# EAGLE design sci fair schematic (EAGLE 7.4.0)
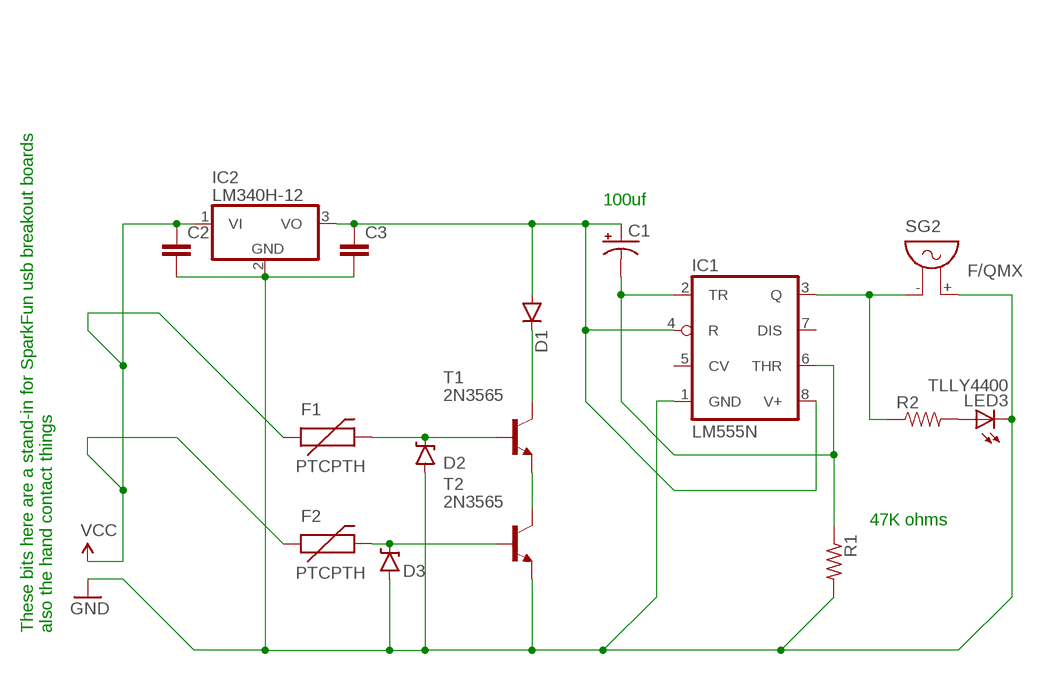
[diagram p0: schematic, sheet 1]

## Parts
C1  CAP_POLPTH1  [CPOL-RADIAL-100UF-25V]
C2  C5/2.5  [C5B2.5]
C3  C5/2.5  [C5B2.5]
D1  DIODEPTH  [DIODE-1N4001]
D2  DIODE-ZENERPTH  [DIODE-ZENER]
D3  DIODE-ZENERPTH  [DIODE-ZENER]
F1  PTCPTH  [PTC]
F2  PTCPTH  [PTC]
IC1  LM555N  [DIL08]
IC2  LM340H-12  [TO220H]
LED3  TLLY4400  [LED3MM]
R1  R-US_0207/12  [0207/12]
R2  RESISTORPTH-1/2W  [AXIAL-0.5]
SG2  F/QMX  [F/QMX]
T1  2N3565  [TO92]
T2  2N3565  [TO92]

## Nets
5V: C1.1(+) C3.1 D1.A IC1.4(R) IC1.8(V+) IC2.3(VO)
GND: C2.2 C3.2 D2.P$2(A) D3.P$2(A) IC1.1(GND) IC2.2(GND) LED3.K(C) R1.2 SG2.+ T2.3(E)
N$4: T1.3(E) T2.1(C)
N$7: D1.C T1.1(C)
N$8: D2.P$1(C) F1.P$2 T1.2(B)
N$9: D3.P$1(C) F2.P$2 T2.2(B)
N$10: IC1.3(Q) R2.P$1 SG2.-
N$11: C1.2(-) IC1.2(TR) IC1.6(THR) R1.1
N$12: LED3.A R2.P$2
VCC: C2.1 F1.P$1 F2.P$1 IC2.1(VI)
Unconnected: IC1.5(CV) IC1.7(DIS)

## Notes on the sheet
- 100uf
- 47K ohms
- These bits here are a stand-in for SparkFun usb breakout boards
  also the hand contact things

## Library data of the parts
C1 = SparkFun-Capacitors:CAP_POL: Capacitor Polarized These are standard SMD and PTH capacitors. Normally 10uF, 47uF, and 100uF in electrolytic and tantalum varieties. Always verify the external diameter of the through hole cap, it varies with capacity, voltage, and manufacturer. The EIA devices should be standard.
C2 C3 = capacitor-wima:C: CAPACITOR naming: grid - package width
D1 = SparkFun-DiscreteSemi:DIODE: Diode These are standard reverse protection diodes and small signal diodes. SMA package can handle up to about 1A. SOD-323 can handle about 200mA. What the SOD-323 package when ordering, there are some mfgs out there that are 5-pin packages.
D2 D3 = SparkFun-DiscreteSemi:DIODE-ZENER: Zener Diode Production Part - 8199 3.4V Zener Voltage
F1 F2 = SparkFun-PowerIC:PTC: Resettable Fuse PTC Resettable Fuse. Spark Fun Electronics SKU : COM-08357
IC1 = linear:*555: TIMER
IC2 = linear:LM340?-*: Positive VOLTAGE REGULATOR Source: http://cache.national.com/ds/LM/LM340.pdf
LED3 = led:TLLY4400: Low Current (2mA) LED 3 mm Tinted Diffused Package color YELLOW Source: Data sheet <http://www.farnell.com/datasheets/391098.pdf>; MF: VISHAY SEMICONDUCTOR; OC_FARNELL: 1612439
R1 = rcl:R-US_: RESISTOR, American symbol
R2 = SparkFun-Passives:RESISTOR: Resistor Basic schematic elements and footprints for 0603, 1206, and PTH resistors.
SG2 = buzzer:F/QMX: BUZZER Source: Buerklin; OC_FARNELL: unknown; OC_NEWARK: unknown
T1 T2 = transistor:2N3565: NPN TRANSISTOR

## Board
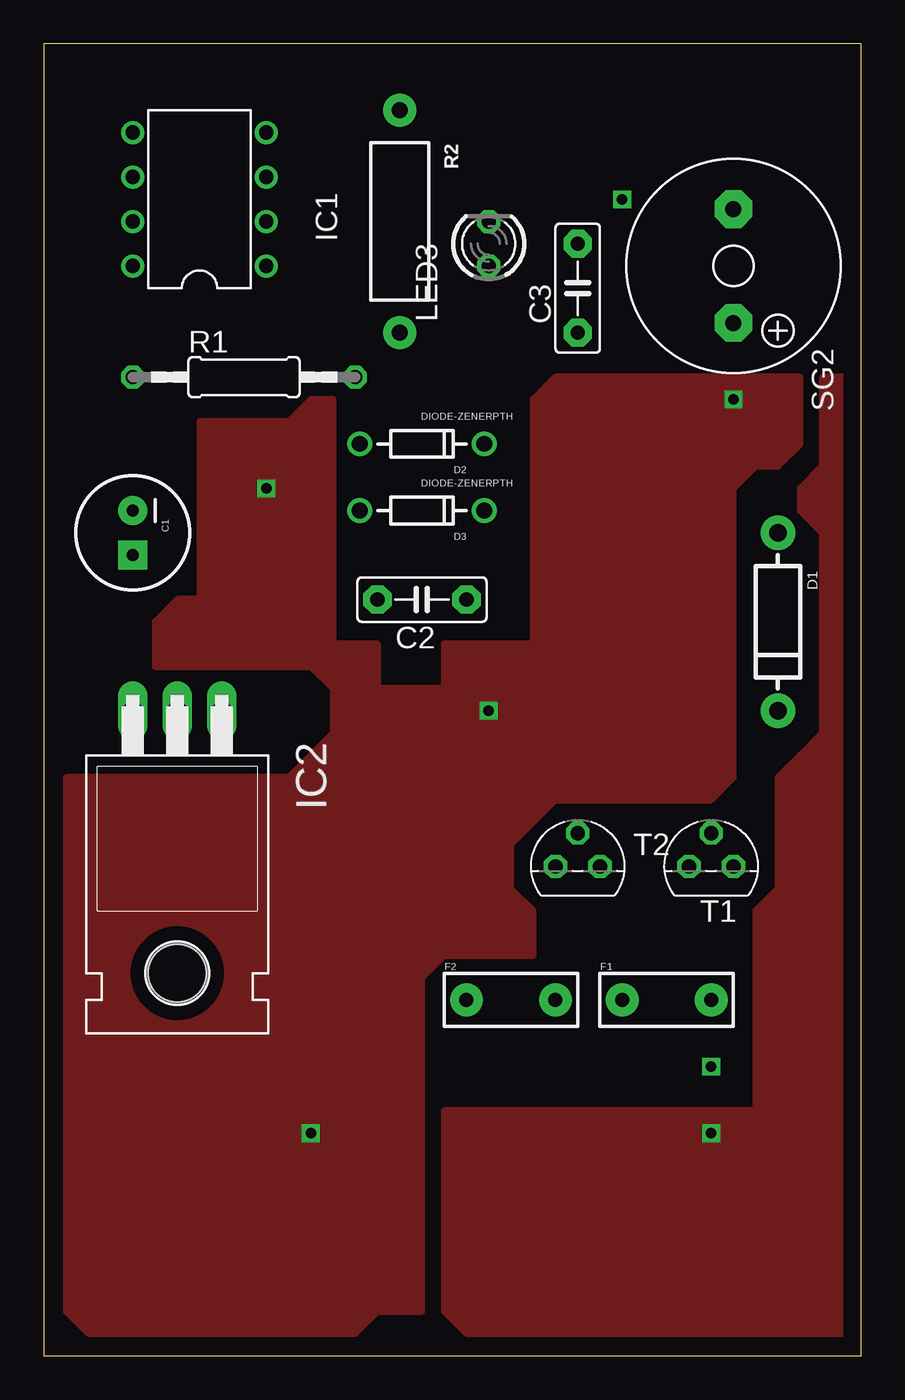
[diagram p1: board, top side]
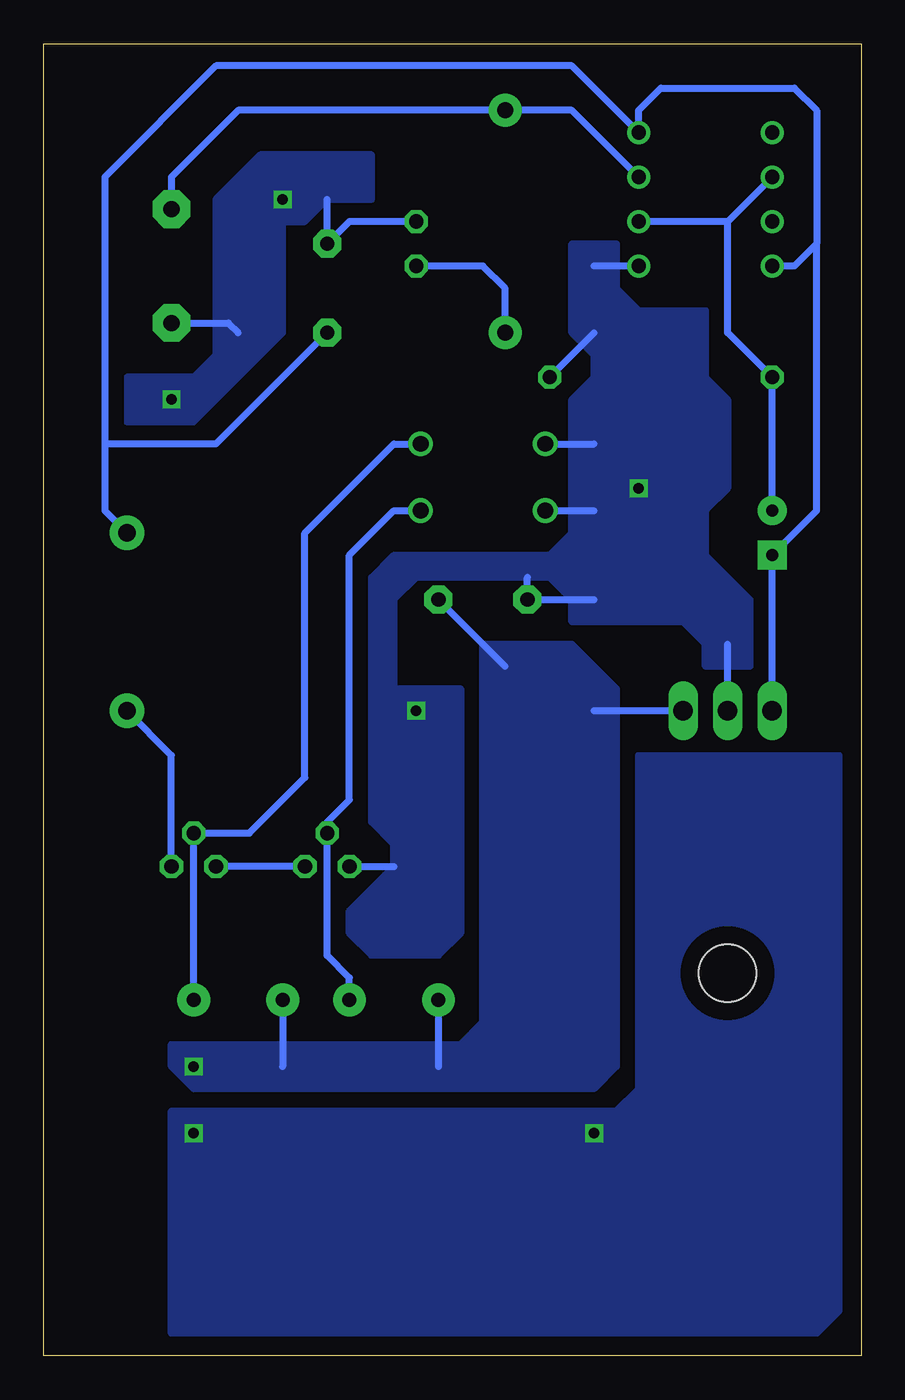
[diagram p2: board, bottom side, seen from below]

Size 46.66 x 74.92 mm. Coordinates in mm from the lower left corner, seen from the top.
Outline: 0,0 46.66,0 46.66,74.92 0,74.92 0,0
Copper layers (1*16): Top 0.035mm / dielectric 1.5mm / Bottom 0.035mm
Design rules "default *": minimum track width 10mil, minimum drill 8mil, track to track 8mil, track to pad 8mil, pad to pad 8mil, via to via 8mil, smd to smd 8mil, copper to edge 40mil, drill to drill 8mil, minimum pad ring 10mil, minimum via ring 8mil, stop-mask expansion 4mil, vias tented up to drill 0mil, thermal gap 10mil

### Footprints (pad centres in the part's own frame; a part is rotated, then mirrored left to right if it is on the bottom)
CPOL-RADIAL-100UF-25V = drill 0.7 pad 1.651 square: 1 1.27,0 | drill 0.7 pad 1.651: 2 -1.27,0
C5B2.5 = drill 0.813 pad 1.6 octagon: 1 -2.54,0; 2 2.54,0
DIODE-1N4001 = drill 1 pad 1.981: A -5.08,0; C 5.08,0
DIODE-ZENER = drill 0.9: P$1 -3.556,0; P$2 3.556,0
PTC = drill 0.8 pad 1.88: P$1 -2.54,0; P$2 2.54,0
DIL08 = drill 0.813 pad 1.27: 1 -3.81,-3.81; 2 -1.27,-3.81; 3 1.27,-3.81; 4 3.81,-3.81; 5 3.81,3.81; 6 1.27,3.81; 7 -1.27,3.81; 8 -3.81,3.81
TO220H = drill 1.118 long: 1 -2.54,-10.16; 2 0,-10.16; 3 2.54,-10.16 | hole 3.302: 0,4.826
LED3MM = drill 0.813 octagon: A -1.27,0; K 1.27,0
0207/12 = drill 0.813 octagon: 1 -6.35,0; 2 6.35,0
AXIAL-0.5 = drill 0.9 pad 1.88: P$1 -6.35,0; P$2 6.35,0
F/QMX = drill 0.914 pad 2.159 octagon: + 3.251,0; - -3.251,0
TO92 = drill 0.813 octagon: 1 1.27,0; 2 0,1.905; 3 -1.27,0

### Placement (x,y rotation side)
C1  5.08,46.99 270 top
C2  21.59,43.18 180 top
C3  30.48,60.96 90 top
D1  41.91,41.91 270 top
D2  21.59,52.07 180 top
D3  21.59,48.26 180 top
F1  35.56,20.32 0 top
F2  26.67,20.32 0 top
IC1  8.89,66.04 90 top
IC2  7.62,26.67 180 top
LED3  25.4,63.5 90 top
R1  11.43,55.88 0 top
R2  20.32,64.77 270 top
SG2  39.37,62.23 270 top
T1  38.1,27.94 0 top
T2  30.48,27.94 0 top

### Tracks (layer width: path | path; a pad name or v marks a point on that pad's centre or on a via)
5V
  Bottom 0.406: 2.54,63.5 2.54,71.12 3.81,72.39 11.43,72.39 12.7,71.12 IC1.4 16.51,73.66 36.83,73.66 43.18,67.31 43.18,52.07 | 2.54,63.5 3.81,62.23 IC1.8 | 2.54,63.5 2.54,48.26 C1.1 IC2.3 | 43.18,52.07 43.18,48.26 D1.A | C3.1 36.83,52.07 43.18,52.07
GND  (via drill 0.6)
  Bottom 0.406: IC1.1 15.24,62.23 | D3.P$2 15.24,48.26 | D2.P$2 15.24,52.07 | IC2.2 7.62,40.64 | 19.05,44.45 C2.2 15.24,43.18 | T2.3 26.67,27.94 | LED3.K 29.21,64.77 C3.2 30.48,66.04 | R1.2 15.24,58.42 | SG2.+ 36.12,58.98 35.56,58.42
  other vias: 33.02,66.04 15.24,12.7 38.1,12.7 25.4,36.83 12.7,49.53 39.37,54.61
  pour Bottom: 12.7,34.29 1.27,34.29 1.27,2.54 2.54,1.27 39.37,1.27 39.37,13.97 13.97,13.97 12.7,15.24
  pour Bottom: 27.94,68.58 34.29,68.58 36.83,66.04 36.83,57.15 38.1,55.88 41.91,55.88 41.91,53.34 38.1,53.34 33.02,58.42 33.02,64.77 31.75,64.77 30.48,66.04 27.94,66.04
  pour Bottom: 27.94,22.86 29.21,24.13 29.21,25.4 26.67,27.94 26.67,29.21 27.94,30.48 27.94,44.45 26.67,45.72 17.78,45.72 16.51,46.99 16.51,54.61 15.24,55.88 15.24,57.15 16.51,58.42 16.51,63.5 13.97,63.5 13.97,60.96 12.7,59.69 8.89,59.69 8.89,55.88 7.62,54.61 7.62,49.53 8.89,48.26 8.89,45.72 6.35,43.18 6.35,39.37 8.89,39.37 8.89,40.64 10.16,41.91 16.51,41.91 16.51,43.18 17.78,44.45 25.4,44.45 26.67,43.18 26.67,38.1 22.86,38.1 22.86,24.13 24.13,22.86
  pour Top: 17.78,1.27 19.05,2.54 21.59,2.54 21.59,21.59 22.86,22.86 27.94,22.86 27.94,25.4 26.67,26.67 26.67,29.21 29.21,31.75 38.1,31.75 39.37,33.02 39.37,49.53 40.64,50.8 41.91,50.8 43.18,52.07 43.18,55.88 29.21,55.88 27.94,54.61 27.94,40.64 22.86,40.64 22.86,38.1 19.05,38.1 19.05,40.64 16.51,40.64 16.51,54.61 15.24,54.61 13.97,53.34 8.89,53.34 8.89,43.18 7.62,43.18 6.35,41.91 6.35,39.37 15.24,39.37 16.51,38.1 16.51,35.56 13.97,33.02 1.27,33.02 1.27,2.54 2.54,1.27
  pour Top: 22.86,2.54 24.13,1.27 45.72,1.27 45.72,55.88 44.45,55.88 44.45,50.8 43.18,49.53 43.18,48.26 44.45,46.99 44.45,35.56 43.18,34.29 41.91,33.02 41.91,26.67 40.64,25.4 40.64,13.97 22.86,13.97
N$4
  Bottom 0.406: T2.1 T1.3
N$7
  Bottom 0.406: T1.1 39.37,34.29 D1.C
N$8
  Bottom 0.406: F1.P$2 T1.2 34.93,29.84 31.75,33.02 31.75,46.99 26.67,52.07 D2.P$1
N$9
  Bottom 0.406: D3.P$1 26.67,48.26 29.21,45.72 29.21,31.75 30.48,30.48 T2.2 30.48,22.86 29.21,21.59 F2.P$2
N$10
  Bottom 0.406: SG2.- 39.37,67.31 35.56,71.12 R2.P$1 16.51,71.12 IC1.3
N$11
  Bottom 0.406: IC1.6 7.62,64.77 | 7.62,64.77 IC1.2 | 7.62,64.77 7.62,58.42 R1.1 C1.2
N$12
  Bottom 0.406: R2.P$2 20.32,60.96 21.59,62.23 LED3.A
VCC  (via drill 0.6)
  Bottom 0.406: IC2.1 15.24,36.83 | C2.1 20.32,39.37 | F2.P$1 24.13,16.51 | F1.P$1 33.02,16.51
  other vias: 38.1,16.51
  pour Bottom: 13.97,38.1 13.97,16.51 15.24,15.24 38.1,15.24 39.37,16.51 39.37,17.78 22.86,17.78 21.59,19.05 21.59,40.64 16.51,40.64